# Altium schematic sheet Xilinx_DDR.SchDoc
size A3; Author: Швецов С.В.; Organization: PapuaSoft; SheetNumber: 6; SheetTotal: 8
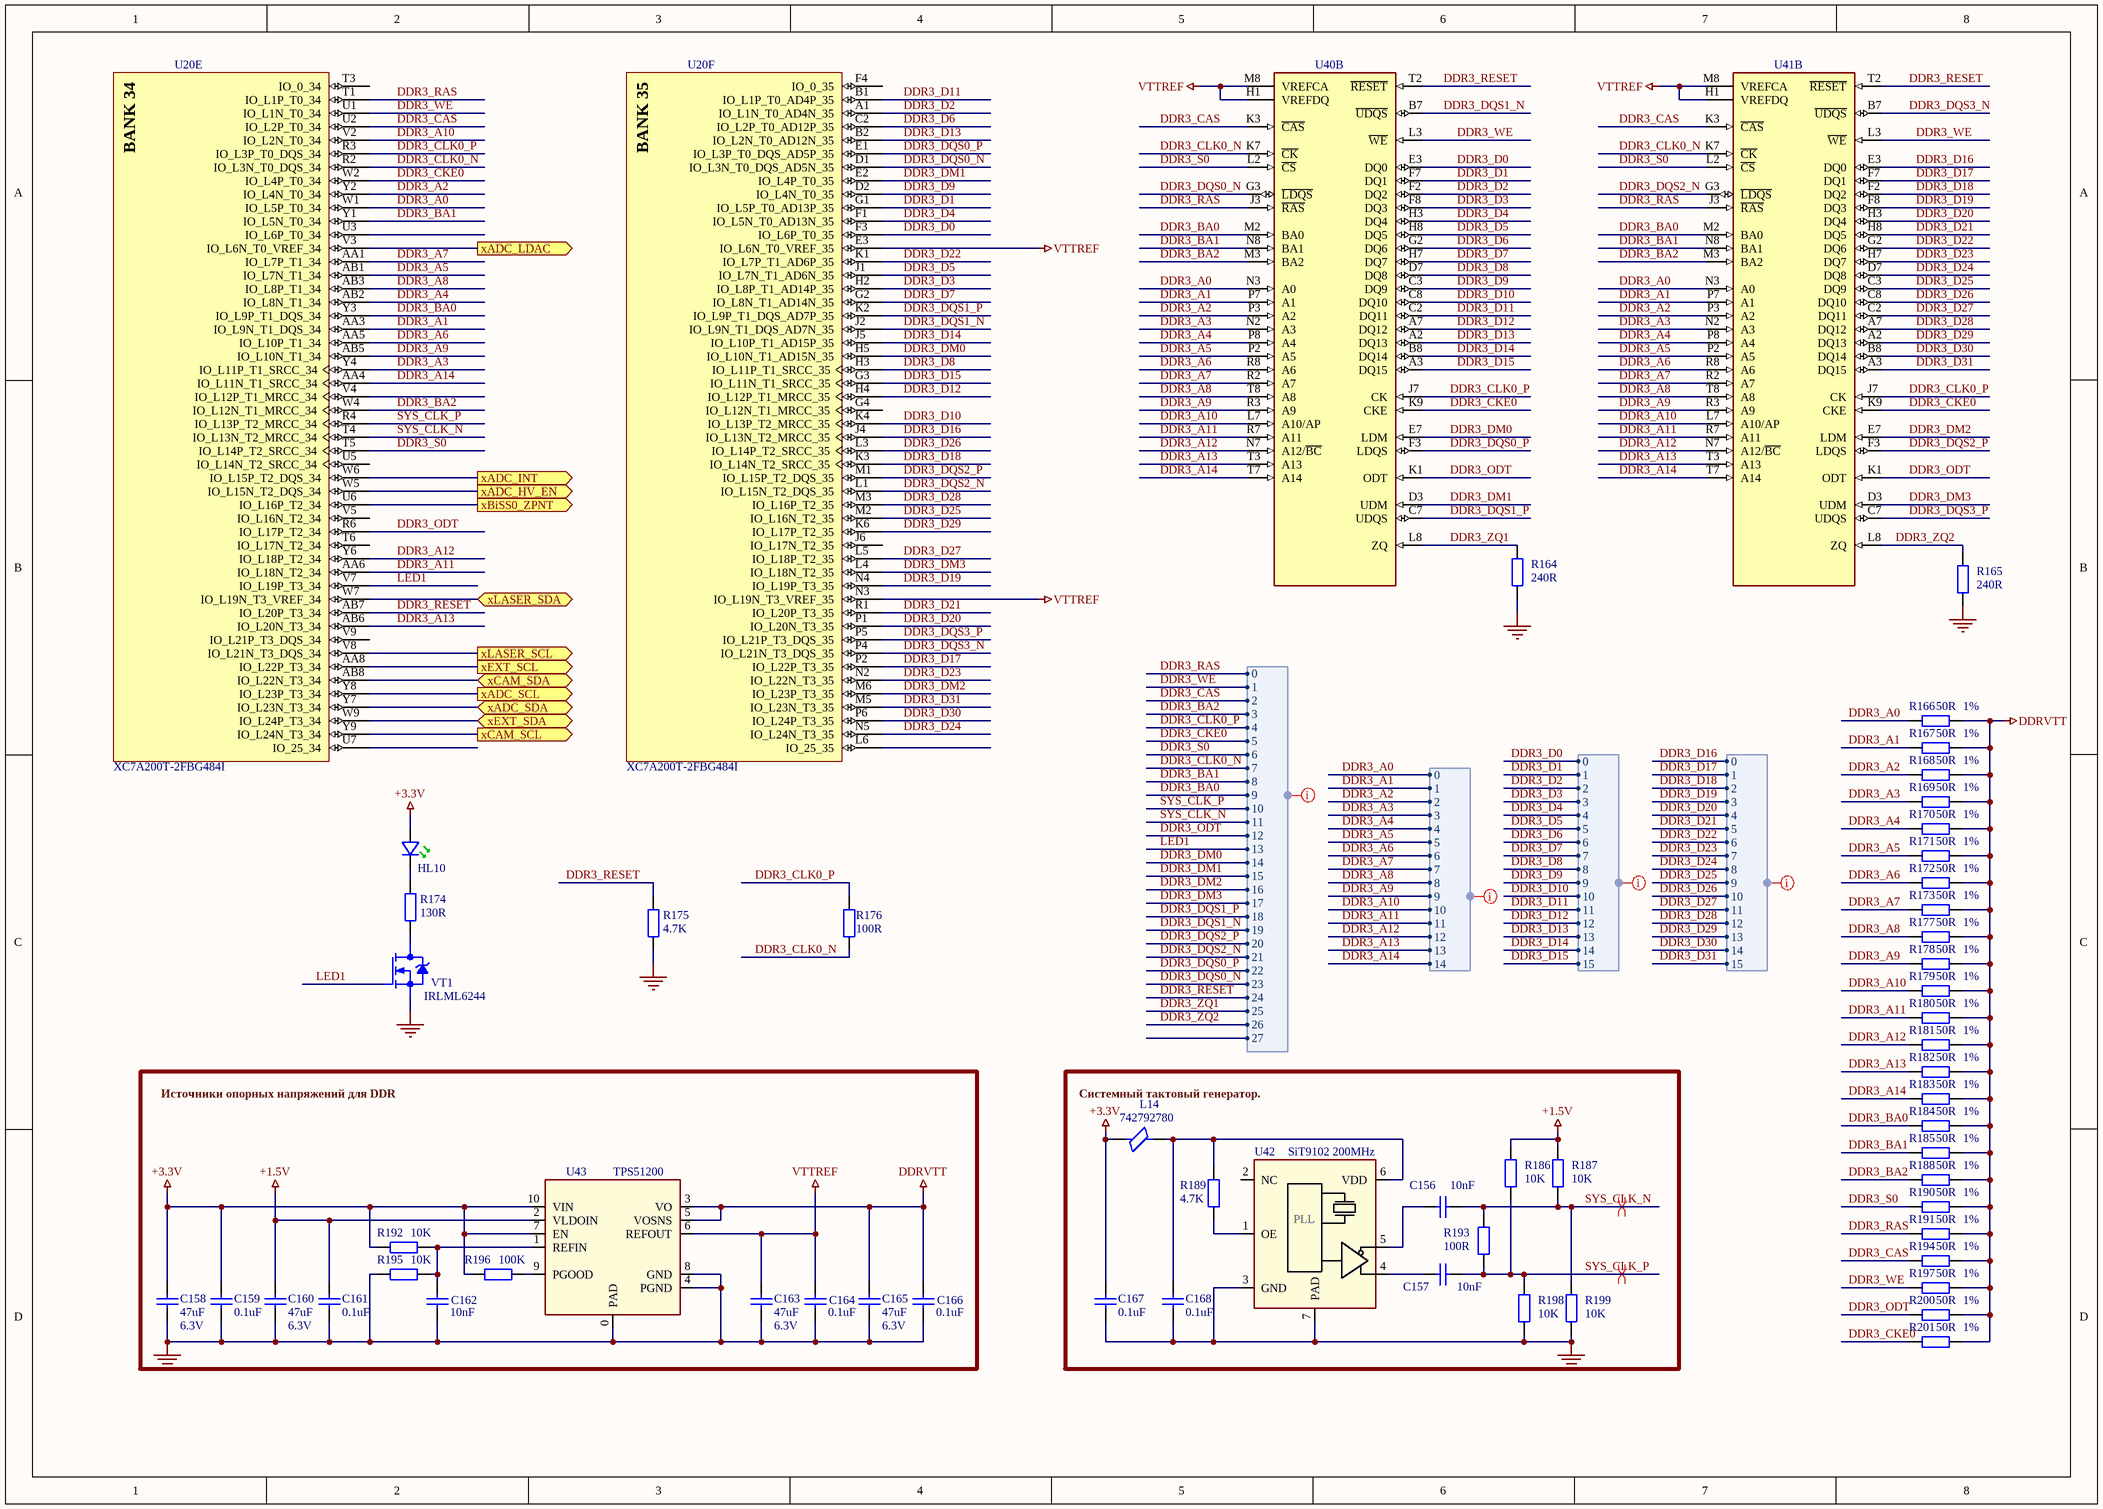
[diagram p0: Xilinx_DDR.SchDoc]

## Parts
C156  value 10nF  [C0402]  (hidden comment: Cap)
C157  value 10nF  [C0402]  (hidden comment: Cap)
C158  value 47uF  Voltage: 6.3V  [C0805]  (hidden comment: Cap)
C159  value 0.1uF  [C0402]  (hidden comment: Cap)
C160  value 47uF  Voltage: 6.3V  [C0805]  (hidden comment: Cap)
C161  value 0.1uF  [C0402]  (hidden comment: Cap)
C162  value 10nF  [C0402]  (hidden comment: Cap)
C163  value 47uF  Voltage: 6.3V  [C0805]  (hidden comment: Cap)
C164  value 0.1uF  [C0402]  (hidden comment: Cap)
C165  value 47uF  Voltage: 6.3V  [C0805]  (hidden comment: Cap)
C166  value 0.1uF  [C0402]  (hidden comment: Cap)
C167  value 0.1uF  [C0402]  (hidden comment: Cap)
C168  value 0.1uF  [C0402]  (hidden comment: Cap)
HL10  (no value)  [KP-1608_16x08x11_L]
L14  742792780  [L0402]
R164  value 240R  [R0402]  (hidden comment: Res2)
R165  value 240R  [R0402]  (hidden comment: Res2)
R166  value 50R  Precision: 1%  [R0402]  (hidden comment: Res2)
R167  value 50R  Precision: 1%  [R0402]  (hidden comment: Res2)
R168  value 50R  Precision: 1%  [R0402]  (hidden comment: Res2)
R169  value 50R  Precision: 1%  [R0402]  (hidden comment: Res2)
R170  value 50R  Precision: 1%  [R0402]  (hidden comment: Res2)
R171  value 50R  Precision: 1%  [R0402]  (hidden comment: Res2)
R172  value 50R  Precision: 1%  [R0402]  (hidden comment: Res2)
R173  value 50R  Precision: 1%  [R0402]  (hidden comment: Res2)
R174  value 130R  [R0402]  (hidden comment: Res2)
R175  value 4.7K  [R0402]  (hidden comment: Res2)
R176  value 100R  [R0402]  (hidden comment: Res2)
R177  value 50R  Precision: 1%  [R0402]  (hidden comment: Res2)
R178  value 50R  Precision: 1%  [R0402]  (hidden comment: Res2)
R179  value 50R  Precision: 1%  [R0402]  (hidden comment: Res2)
R180  value 50R  Precision: 1%  [R0402]  (hidden comment: Res2)
R181  value 50R  Precision: 1%  [R0402]  (hidden comment: Res2)
R182  value 50R  Precision: 1%  [R0402]  (hidden comment: Res2)
R183  value 50R  Precision: 1%  [R0402]  (hidden comment: Res2)
R184  value 50R  Precision: 1%  [R0402]  (hidden comment: Res2)
R185  value 50R  Precision: 1%  [R0402]  (hidden comment: Res2)
R186  value 10K  [R0402]  (hidden comment: Res2)
R187  value 10K  [R0402]  (hidden comment: Res2)
R188  value 50R  Precision: 1%  [R0402]  (hidden comment: Res2)
R189  value 4.7K  [R0402]  (hidden comment: Res2)
R190  value 50R  Precision: 1%  [R0402]  (hidden comment: Res2)
R191  value 50R  Precision: 1%  [R0402]  (hidden comment: Res2)
R192  value 10K  [R0402]  (hidden comment: Res2)
R193  value 100R  [R0402]  (hidden comment: Res2)
R194  value 50R  Precision: 1%  [R0402]  (hidden comment: Res2)
R195  value 10K  [R0402]  (hidden comment: Res2)
R196  value 100K  [R0402]  (hidden comment: Res2)
R197  value 50R  Precision: 1%  [R0402]  (hidden comment: Res2)
R198  value 10K  [R0402]  (hidden comment: Res2)
R199  value 10K  [R0402]  (hidden comment: Res2)
R200  value 50R  Precision: 1%  [R0402]  (hidden comment: Res2)
R201  value 50R  Precision: 1%  [R0402]  (hidden comment: Res2)
U20  XC7A200T-2FBG484I  [FBG484]  (parts E,F of 11)
U40  MT41J256M16HA-125-E  [FBGA96_9X14_MRN]  (value not drawn)  (part B of 2)
U41  MT41J256M16HA-125-E  [FBGA96_9X14_MRN]  (value not drawn)  (part B of 2)
U42  SiT9102 200MHz  [SMD_AI-243N33E200.00000X_SIT-L]
U43  TPS51200  [TPS51200AQDRCRQ1]
VT1  IRLML6244  [SOT23_123]

## Ports
xADC_HV_EN (out), xADC_INT (out), xADC_LDAC (out), xADC_SCL (out), xADC_SDA (bidir), xBiSS0_ZPNT (out), xCAM_SCL (out), xCAM_SDA (bidir), xEXT_SCL (out), xEXT_SDA (bidir), xLASER_SCL (out), xLASER_SDA (bidir)

## Harnesses
DDR3_DATA: 0, 1, 2, 3, 4, 5, 6, 7, 8, 9, 10, 12, 13, 14, 15, 11
DDR3_ADDR: 0, 1, 2, 3, 4, 5, 6, 7, 8, 9, 10, 12, 13, 14, 11
DDR3_ADDR: 0, 1, 2, 3, 4, 5, 6, 7, 8, 9, 10, 12, 13, 14, 11, 15, 16, 17, 18, 19, 20, 21, 22, 23, 24, 25, 26, 27

## Nets
+1.5V: C160.1 C161.2 R186.1 R187.1 U43.2(VLDOIN)
+3.3V: C158.1 C159.2 C167.2 HL10.1(Anode) L14.1 R192.1 R196.1 U43.7(EN) U43.10(VIN)
DDRVTT: C165.1 C166.1 R166.2 R167.2 R168.2 R169.2 R170.2 R171.2 R172.2 R173.2 R177.2 R178.2 R179.2 R180.2 R181.2 R182.2 R183.2 R184.2 R185.2 R188.2 R190.2 R191.2 R194.2 R197.2 R200.2 R201.2 U43.3(VO) U43.5(VOSNS)
GND: C158.2 C159.1 C160.2 C161.1 C162.2 C163.2 C164.2 C165.2 C166.2 C167.1 C168.1 R164.1 R165.1 R175.1 R195.1 R198.2 R199.2 U42.3(GND) U42.7(PAD) U43.0(PAD) U43.4(PGND) U43.8(GND) VT1.2(Sourse)
VTTREF: C163.1 C164.1 U20.E3(IO_L6N_T0_VREF_35) U20.N3(IO_L19N_T3_VREF_35) U40.H1(VREFDQ) U40.M8(VREFCA) U41.H1(VREFDQ) U41.M8(VREFCA) U43.6(REFOUT)
DDR3_A0: R166.1 U20.W1(IO_L5P_T0_34) U40.N3(A0) U41.N3(A0) ; harness DDR3_ADDR.0
DDR3_A1: R167.1 U20.AA3(IO_L9N_T1_DQS_34) U40.P7(A1) U41.P7(A1) ; harness DDR3_ADDR.1
DDR3_A2: R168.1 U20.Y2(IO_L4N_T0_34) U40.P3(A2) U41.P3(A2) ; harness DDR3_ADDR.2
DDR3_A3: R169.1 U20.Y4(IO_L11P_T1_SRCC_34) U40.N2(A3) U41.N2(A3) ; harness DDR3_ADDR.3
DDR3_A4: R170.1 U20.AB2(IO_L8N_T1_34) U40.P8(A4) U41.P8(A4) ; harness DDR3_ADDR.4
DDR3_A5: R171.1 U20.AB1(IO_L7N_T1_34) U40.P2(A5) U41.P2(A5) ; harness DDR3_ADDR.5
DDR3_A6: R172.1 U20.AA5(IO_L10P_T1_34) U40.R8(A6) U41.R8(A6) ; harness DDR3_ADDR.6
DDR3_A7: R173.1 U20.AA1(IO_L7P_T1_34) U40.R2(A7) U41.R2(A7) ; harness DDR3_ADDR.7
DDR3_A8: R177.1 U20.AB3(IO_L8P_T1_34) U40.T8(A8) U41.T8(A8) ; harness DDR3_ADDR.8
DDR3_A9: R178.1 U20.AB5(IO_L10N_T1_34) U40.R3(A9) U41.R3(A9) ; harness DDR3_ADDR.9
DDR3_A10: R179.1 U20.V2(IO_L2N_T0_34) U40.L7(A10/AP) U41.L7(A10/AP) ; harness DDR3_ADDR.10
DDR3_A11: R180.1 U20.AA6(IO_L18N_T2_34) U40.R7(A11) U41.R7(A11) ; harness DDR3_ADDR.11
DDR3_A12: R181.1 U20.Y6(IO_L18P_T2_34) U40.N7(A12/~{BC}) U41.N7(A12/~{BC}) ; harness DDR3_ADDR.12
DDR3_A13: R182.1 U20.AB6(IO_L20N_T3_34) U40.T3(A13) U41.T3(A13) ; harness DDR3_ADDR.13
DDR3_A14: R183.1 U20.AA4(IO_L11N_T1_SRCC_34) U40.T7(A14) U41.T7(A14) ; harness DDR3_ADDR.14
DDR3_BA0: R184.1 U20.Y3(IO_L9P_T1_DQS_34) U40.M2(BA0) U41.M2(BA0) ; harness DDR3_ADDR.9
DDR3_BA1: R185.1 U20.Y1(IO_L5N_T0_34) U40.N8(BA1) U41.N8(BA1) ; harness DDR3_ADDR.8
DDR3_BA2: R188.1 U20.W4(IO_L12N_T1_MRCC_34) U40.M3(BA2) U41.M3(BA2) ; harness DDR3_ADDR.3
DDR3_CAS: R194.1 U20.U2(IO_L2P_T0_34) U40.K3(~{CAS}) U41.K3(~{CAS}) ; harness DDR3_ADDR.2
DDR3_CKE0: R201.1 U20.W2(IO_L4P_T0_34) U40.K9(CKE) U41.K9(CKE) ; harness DDR3_ADDR.5
DDR3_CLK0_N: R176.2 U20.R2(IO_L3N_T0_DQS_34) U40.K7(~{CK}) U41.K7(~{CK}) ; harness DDR3_ADDR.7
DDR3_CLK0_P: R176.1 U20.R3(IO_L3P_T0_DQS_34) U40.J7(CK) U41.J7(CK) ; harness DDR3_ADDR.4
DDR3_D0: U20.F3(IO_L6P_T0_35) U40.E3(DQ0) ; harness DDR3_DATA.0
DDR3_D1: U20.G1(IO_L5P_T0_AD13P_35) U40.F7(DQ1) ; harness DDR3_DATA.1
DDR3_D2: U20.A1(IO_L1N_T0_AD4N_35) U40.F2(DQ2) ; harness DDR3_DATA.2
DDR3_D3: U20.H2(IO_L8P_T1_AD14P_35) U40.F8(DQ3) ; harness DDR3_DATA.3
DDR3_D4: U20.F1(IO_L5N_T0_AD13N_35) U40.H3(DQ4) ; harness DDR3_DATA.4
DDR3_D5: U20.J1(IO_L7N_T1_AD6N_35) U40.H8(DQ5) ; harness DDR3_DATA.5
DDR3_D6: U20.C2(IO_L2P_T0_AD12P_35) U40.G2(DQ6) ; harness DDR3_DATA.6
DDR3_D7: U20.G2(IO_L8N_T1_AD14N_35) U40.H7(DQ7) ; harness DDR3_DATA.7
DDR3_D8: U20.H3(IO_L11P_T1_SRCC_35) U40.D7(DQ8) ; harness DDR3_DATA.8
DDR3_D9: U20.D2(IO_L4N_T0_35) U40.C3(DQ9) ; harness DDR3_DATA.9
DDR3_D10: U20.K4(IO_L13P_T2_MRCC_35) U40.C8(DQ10) ; harness DDR3_DATA.10
DDR3_D11: U20.B1(IO_L1P_T0_AD4P_35) U40.C2(DQ11) ; harness DDR3_DATA.11
DDR3_D12: U20.H4(IO_L12P_T1_MRCC_35) U40.A7(DQ12) ; harness DDR3_DATA.12
DDR3_D13: U20.B2(IO_L2N_T0_AD12N_35) U40.A2(DQ13) ; harness DDR3_DATA.13
DDR3_D14: U20.J5(IO_L10P_T1_AD15P_35) U40.B8(DQ14) ; harness DDR3_DATA.14
DDR3_D15: U20.G3(IO_L11N_T1_SRCC_35) U40.A3(DQ15) ; harness DDR3_DATA.15
DDR3_D16: U20.J4(IO_L13N_T2_MRCC_35) U41.E3(DQ0) ; harness DDR3_DATA.0
DDR3_D17: U20.P2(IO_L22P_T3_35) U41.F7(DQ1) ; harness DDR3_DATA.1
DDR3_D18: U20.K3(IO_L14N_T2_SRCC_35) U41.F2(DQ2) ; harness DDR3_DATA.2
DDR3_D19: U20.N4(IO_L19P_T3_35) U41.F8(DQ3) ; harness DDR3_DATA.3
DDR3_D20: U20.P1(IO_L20N_T3_35) U41.H3(DQ4) ; harness DDR3_DATA.4
DDR3_D21: U20.R1(IO_L20P_T3_35) U41.H8(DQ5) ; harness DDR3_DATA.5
DDR3_D22: U20.K1(IO_L7P_T1_AD6P_35) U41.G2(DQ6) ; harness DDR3_DATA.6
DDR3_D23: U20.N2(IO_L22N_T3_35) U41.H7(DQ7) ; harness DDR3_DATA.7
DDR3_D24: U20.N5(IO_L24N_T3_35) U41.D7(DQ8) ; harness DDR3_DATA.8
DDR3_D25: U20.M2(IO_L16N_T2_35) U41.C3(DQ9) ; harness DDR3_DATA.9
DDR3_D26: U20.L3(IO_L14P_T2_SRCC_35) U41.C8(DQ10) ; harness DDR3_DATA.10
DDR3_D27: U20.L5(IO_L18P_T2_35) U41.C2(DQ11) ; harness DDR3_DATA.11
DDR3_D28: U20.M3(IO_L16P_T2_35) U41.A7(DQ12) ; harness DDR3_DATA.12
DDR3_D29: U20.K6(IO_L17P_T2_35) U41.A2(DQ13) ; harness DDR3_DATA.13
DDR3_D30: U20.P6(IO_L24P_T3_35) U41.B8(DQ14) ; harness DDR3_DATA.14
DDR3_D31: U20.M5(IO_L23N_T3_35) U41.A3(DQ15) ; harness DDR3_DATA.15
DDR3_DM0: U20.H5(IO_L10N_T1_AD15N_35) U40.E7(LDM) ; harness DDR3_ADDR.14
DDR3_DM1: U20.E2(IO_L4P_T0_35) U40.D3(UDM) ; harness DDR3_ADDR.15
DDR3_DM2: U20.M6(IO_L23P_T3_35) U41.E7(LDM) ; harness DDR3_ADDR.16
DDR3_DM3: U20.L4(IO_L18N_T2_35) U41.D3(UDM) ; harness DDR3_ADDR.17
DDR3_DQS0_N: U20.D1(IO_L3N_T0_DQS_AD5N_35) U40.G3(~{LDQS}) ; harness DDR3_ADDR.23
DDR3_DQS0_P: U20.E1(IO_L3P_T0_DQS_AD5P_35) U40.F3(LDQS) ; harness DDR3_ADDR.22
DDR3_DQS1_N: U20.J2(IO_L9N_T1_DQS_AD7N_35) U40.B7(~{UDQS}) ; harness DDR3_ADDR.19
DDR3_DQS1_P: U20.K2(IO_L9P_T1_DQS_AD7P_35) U40.C7(UDQS) ; harness DDR3_ADDR.18
DDR3_DQS2_N: U20.L1(IO_L15N_T2_DQS_35) U41.G3(~{LDQS}) ; harness DDR3_ADDR.21
DDR3_DQS2_P: U20.M1(IO_L15P_T2_DQS_35) U41.F3(LDQS) ; harness DDR3_ADDR.20
DDR3_DQS3_N: U20.P4(IO_L21N_T3_DQS_35) U41.B7(~{UDQS})
DDR3_DQS3_P: U20.P5(IO_L21P_T3_DQS_35) U41.C7(UDQS)
DDR3_ODT: R200.1 U20.R6(IO_L17P_T2_34) U40.K1(ODT) U41.K1(ODT) ; harness DDR3_ADDR.12
DDR3_RAS: R191.1 U20.T1(IO_L1P_T0_34) U40.J3(~{RAS}) U41.J3(~{RAS}) ; harness DDR3_ADDR.0
DDR3_RESET: R175.2 U20.AB7(IO_L20P_T3_34) U40.T2(~{RESET}) U41.T2(~{RESET}) ; harness DDR3_ADDR.24
DDR3_S0: R190.1 U20.T5(IO_L14P_T2_SRCC_34) U40.L2(~{CS}) U41.L2(~{CS}) ; harness DDR3_ADDR.6
DDR3_WE: R197.1 U20.U1(IO_L1N_T0_34) U40.L3(~{WE}) U41.L3(~{WE}) ; harness DDR3_ADDR.1
DDR3_ZQ1: R164.2 U40.L8(ZQ) ; harness DDR3_ADDR.25
DDR3_ZQ2: R165.2 U41.L8(ZQ) ; harness DDR3_ADDR.26
LED1: U20.V7(IO_L19P_T3_34) VT1.1(Gate) ; harness DDR3_ADDR.13
SYS_CLK_N: C156.2 R187.2 R193.1 R199.1 U20.T4(IO_L13N_T2_MRCC_34) ; harness DDR3_ADDR.11
SYS_CLK_P: C157.2 R186.2 R193.2 R198.1 U20.R4(IO_L13P_T2_MRCC_34) ; harness DDR3_ADDR.10
xADC_HV_EN: U20.W5(IO_L15N_T2_DQS_34) ; port xADC_HV_EN
xADC_INT: U20.W6(IO_L15P_T2_DQS_34) ; port xADC_INT
xADC_LDAC: U20.V3(IO_L6N_T0_VREF_34) ; port xADC_LDAC
xADC_SCL: U20.Y8(IO_L23P_T3_34) ; port xADC_SCL
xADC_SDA: U20.Y7(IO_L23N_T3_34) ; port xADC_SDA
xBiSS0_ZPNT: U20.U6(IO_L16P_T2_34) ; port xBiSS0_ZPNT
xCAM_SCL: U20.Y9(IO_L24N_T3_34) ; port xCAM_SCL
xCAM_SDA: U20.AB8(IO_L22N_T3_34) ; port xCAM_SDA
xEXT_SCL: U20.AA8(IO_L22P_T3_34) ; port xEXT_SCL
xEXT_SDA: U20.W9(IO_L24P_T3_34) ; port xEXT_SDA
xLASER_SCL: U20.V8(IO_L21N_T3_DQS_34) ; port xLASER_SCL
xLASER_SDA: U20.W7(IO_L19N_T3_VREF_34) ; port xLASER_SDA
NetC156_1: C156.1 U42.5(CLKN)
NetC157_1: C157.1 U42.4(CLKP)
NetC162_1: C162.1 R192.2 R195.2 U43.1(REFIN)
NetC168_2: C168.2 L14.2 R189.2 U42.6(VDD)
NetHL10_2: HL10.2(Cathode) R174.2
NetR174_1: R174.1 VT1.3(Drain)
NetR189_1: R189.1 U42.1(OE)
NetR196_2: R196.2 U43.9(PGOOD)

Not connected (* = marked no-connect by the designer): U20 F4(IO_0_35) G4(IO_L12N_T1_MRCC_35) J6(IO_L17N_T2_35) L6(IO_25_35) T3(IO_0_34) T6(IO_L17N_T2_34) U3(IO_L6P_T0_34) U5(IO_L14N_T2_SRCC_34) U7(IO_25_34) V4(IO_L12P_T1_MRCC_34) V5(IO_L16N_T2_34) V9(IO_L21P_T3_DQS_34); U42 2(NC); U43 173 174

## Layout directives
net class DDR_DATA_0_15: (no net found under the mark)
net class DDR_DATA_16_31: (no net found under the mark)
net class DDR_ADDR: (no net found under the mark)
net class PLIS_OTHER: (no net found under the mark)
differential pair: SYS_CLK_N, SYS_CLK_P

## Notes on the sheet
- Источники опорных напряжений для DDR
- (near L14) Системный тактовый генератор.
- Лист
- /
- Изм.
- № докум.
- Подп.
- Дата.
- (in symbol SiT9102) PLL
- (in symbol XC7A200T-2FBG484I, part E) BANK 34
- (in symbol XC7A200T-2FBG484I, part F) BANK 35

## Library data of the parts
C156 C157 C159 C161 C162 C164 C166-C168 = Cap: Конденсатор керамический; Voltage: 25V; PackageReference: 0402
  C156 C157 C159 C161 C167 C168: ClassName: SystemCLK
  C162 C164 C166: ClassName: Xilinx DDR
C158 C160 C163 C165 = Cap: C0805C476M9PAC; PackageReference: 0805; ClassName: Xilinx PWR
HL10 = ledG_KP-1608MGC_KP-1608: 1.6X0.8mm SMD  LED; LxWxH(mm): 1,6x0,8x1,1; Value: KP-1608MGC; PackageReference: 0603; Package: KP-1608_16x08x11
L14 = BEAD_FERRITE_SM: Wurth Elektronik EMI FILTERS FERRITE BEAD, 220R@100MHz, 0.35R; PackageReference: 0402; Value: 742792780; ClassName: SystemCLK
R164-R191 R193 R194 R196-R201 = Res2: Резистор; PackageReference: 0402
  R164-R173 R175-R185 R188 R190 R191 R194 R196 R197 R200 R201: ClassName: Xilinx DDR
  R186 R187 R189 R193 R198 R199: ClassName: SystemCLK
R192 R195 = Res2: Резистор; Precision: 1%; PackageReference: 0402; ClassName: Xilinx DDR
U20 = XC7A200T-2FBG484I: Artix-7 FPGA, 285 User I/Os, 4 GTP, 484-Ball BGA; Manufacturer: Xilinx; CLBs (Slices): 33650; DSP48E1 Slices: 740; Block RAM Blocks (36Kb): 365; Logic Cells: 215360; Block RAM Blocks (Max Kb): 13140; Speed Grade: -2; Clock Mgmt Tiles (CMTs): 10; Block RAM Blocks (18Kb): 730; Max User I/O: 500; ComponentLink5Description: Packaging and Pinout; CLBs (Max Distributed RAM Kb): 2888; ComponentLink4Description: Package File; ComponentLink5URL: http://www.xilinx.com/support/documentation/user_guides/ug475_7Series_Pkg_Pinout.pdf; ComponentLink1Description: Datasheet; ComponentLink2Description: Package Specification; DatasheetVersion: v1.12; ComponentLink3URL: http://www.xilinx.com/support/documentation/data_sheets/ds181_Artix_7_Data_Sheet.pdf; ComponentLink1URL: http://www.xilinx.com/support/documentation/data_sheets/ds180_7Series_Overview.pdf; Code_JEDEC: MS-034; ComponentLink2URL: http://www.xilinx.com/support/documentation/user_guides/ug475_7Series_Pkg_Pinout.pdf; ComponentLink3Description: DC and Switching Characteristics; Generic Part Number: XC7A200T; RoHS: Pb-Free; ComponentLink4URL: http://www.xilinx.com/support/packagefiles/a7packages/xc7a200tfbg484pkg.txt; PackageVersion: Rev 1.8; Mounting Technology: Surface Mount; PackageReference: FBG484; PackageDescription: Flip-Chip Lidless BGA, Body 23 x 23 mm, 1.0 mm Pitch; Value: XC7A200T-2FBG484I; ClassName: *
U40 U41 = MT41J256M16HA-125-E: DDR3 SDRAM 32Meg x 16 x 8 banks; Value: MT41J256M16HA-125-E; PackageReference: FBGA-96
U42 = SiT9102: 200 MHz XO LVDS Oscillator 3.3V; Value: SIT9102AI-243N33E200.00000X; PackageReference: SMD 5.0x3.2x0.75; ClassName: SystemCLK
U43 = TPS51200: Sink and Source DDR Termination Regulator; Value: TPS51200; PackageReference: VSON10; ClassName: Xilinx DDR
VT1 = MOSFET-N/SOT23: MOSFET-N 1.5V порог переключения.; Value: IRLML6244TRPbF; PackageReference: SOT23